# Altium schematic sheet switchreg.SchDoc
size A4
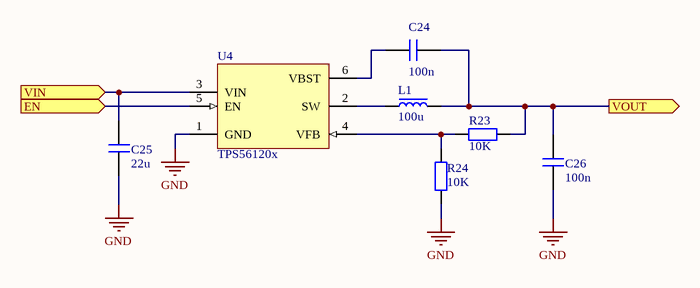
[diagram p0: switchreg.SchDoc]

## Parts
C24  value 100n  [CAPC1005X06N]  (hidden comment: cap)
C25  value 22u  [CAPC2012X11N]  (hidden comment: cap)
C26  value 100n  [CAPC2012X11N]  (hidden comment: cap)
L1  value 100u  [INDC4040X18N]  (hidden comment: inds)
R23  value 10K  [RESC1005X04N]  (hidden comment: res)
R24  value 10K  [RESC1005X04N]  (hidden comment: res)
U4  TPS56120x  [SOT95P280X110-6N]

## Ports
EN (in), VIN (in), VOUT (out)

## Nets
GND: C25.1 C26.1 R24.1 U4.1(GND)
EN: U4.5(EN) ; port EN
VIN: C25.2 U4.3(VIN) ; port VIN
VOUT: C24.2 C26.2 L1.2 R23.2 ; port VOUT
NetC24_1: C24.1 U4.6(VBST)
NetL1_1: L1.1 U4.2(SW)
NetR23_1: R23.1 R24.2 U4.4(VFB)

## Notes on the sheet
- Title
- Size:
- Date:
- A4
- Number:
- Time:
- Revision:
- Sheet
- of
- File:

## Library data of the parts
C24-C26 = cap: Capacitor
L1 = inds: Inductor
R23 R24 = res: Resistor
U4 = tps56120x: 4.5-V to 17-V Input, 1-A Synchronous  Step-Down  Voltage  Regulator  in 6-Pin  SOT-23